# Altium schematic sheet ALIM_MOSFET.SchDoc
size A4; SheetNumber: 2; SheetTotal: 8
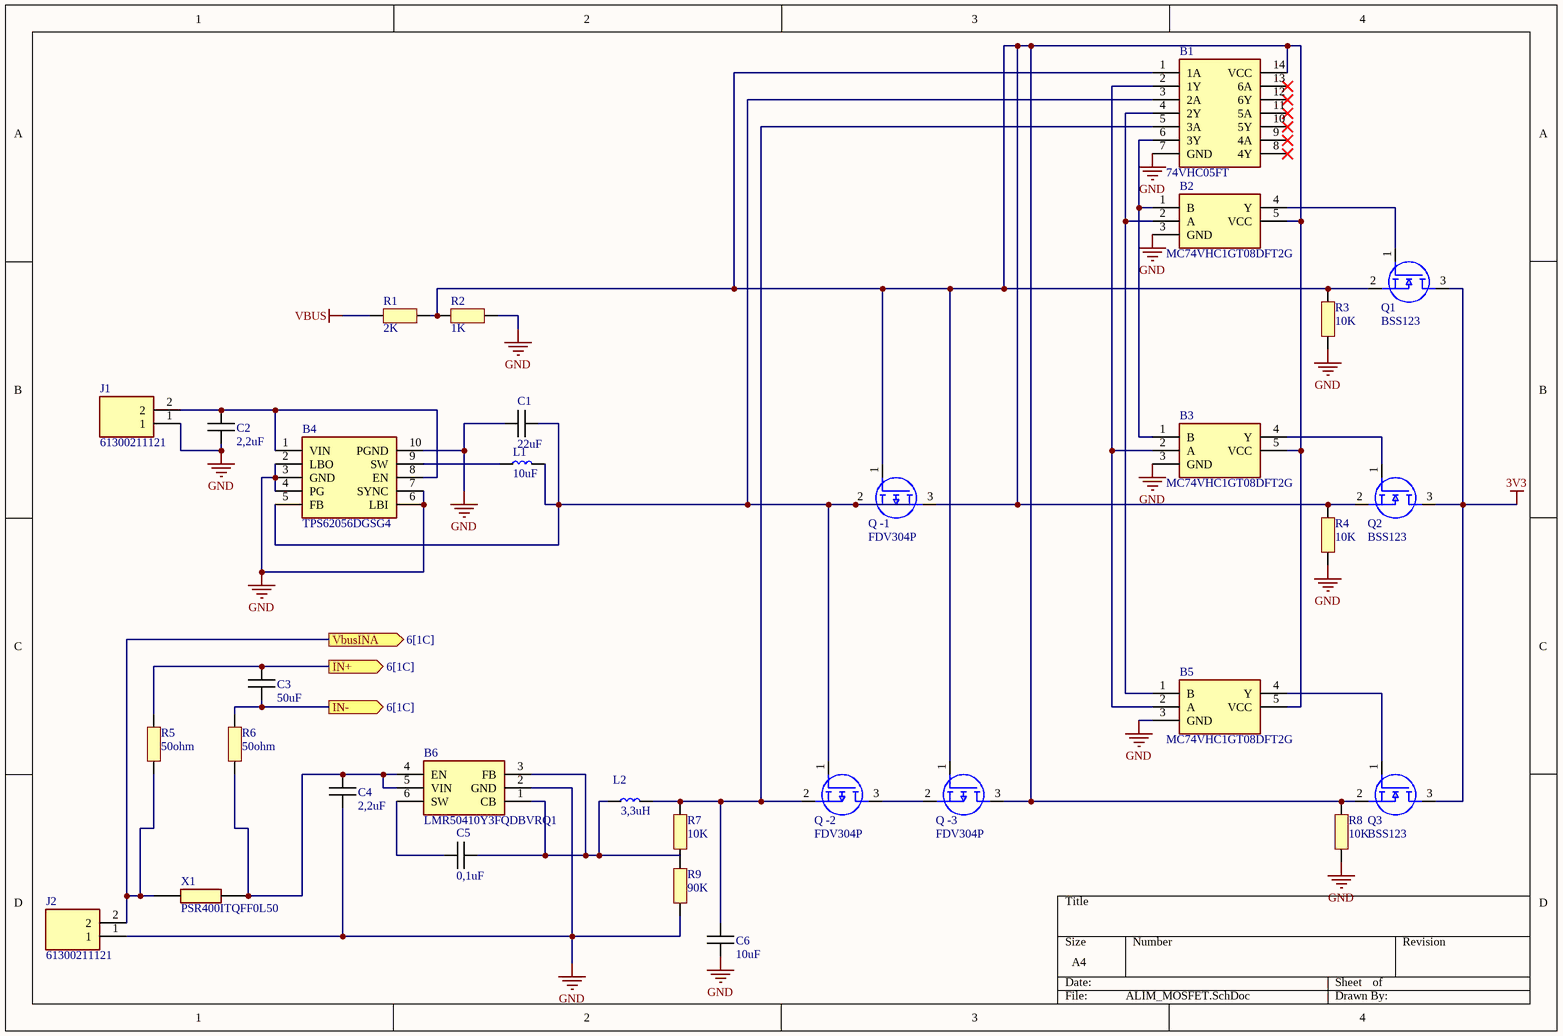
[diagram p0: ALIM_MOSFET.SchDoc]

## Parts
B1  74VHC05FT  [SOP65P640X120-14N]
B2  MC74VHC1GT08DFT2G  [SOT65P210X110-5N]
B3  MC74VHC1GT08DFT2G  [SOT65P210X110-5N]
B4  TPS62056DGSG4  [SOP50P490X110-10N]
B5  MC74VHC1GT08DFT2G  [SOT65P210X110-5N]
B6  LMR50410Y3FQDBVRQ1  [SOT95P280X145-6N]
C1  22uF  [CAPC1005X06N]
C2  2,2uF  [CAPC1005X06N]
C3  50uF  [CAPC1005X06N]
C4  2,2uF  [CAPC1005X06N]
C5  0,1uF  [CAPC1005X06N]
C6  10uF  [CAPC1005X06N]
J1  61300211121  [61300211121]
J2  61300211121  [61300211121]
L1  10uF  [LQPC1005X06N]
L2  3,3uH  [LQPC1005X06N]
Q1  BSS123  [BSS123]
Q2  BSS123  [BSS123]
Q3  BSS123  [BSS123]
Q_-1  FDV304P  [SOT95P251X112-3N]
Q_-2  FDV304P  [SOT95P251X112-3N]
Q_-3  FDV304P  [SOT95P251X112-3N]
R1  2K  [RESC1005X06N]
R2  1K  [RESC1005X06N]
R3  10K  [RESC1005X06N]
R4  10K  [RESC1005X06N]
R5  50ohm  [RESC1005X06N]
R6  50ohm  [RESC1005X06N]
R7  10K  [RESC1005X06N]
R8  10K  [RESC1005X06N]
R9  90K  [RESC1005X06N]
X1  PSR400ITQFF0L50  [RESC10052X200N]

## Ports
IN+ (out, see 6[1C]), IN- (out, see 6[1C]), VbusINA (out, see 6[1C])

## Nets
3V3: Q1.3(D) Q2.3(D) Q3.3(D)
GND: B1.7(GND) B2.3(GND) B3.3(GND) B4.2(LBO) B4.3(GND) B4.4(PG) B4.6(LBI) B4.7(SYNC) B4.10(PGND) B5.3(GND) B6.2(GND) C1.2 C2.2 C4.2 C6.2 J1.1 J2.1 R2.2 R3.2 R4.2 R8.2 R9.2
VBUS: R1.1
IN+: C3.1 R5.2 ; port IN+
IN-: C3.2 R6.2 ; port IN-
VbusINA: J2.2 R5.1 X1.1 ; port VbusINA
NetB1_1: B1.1(1A) B1.14(VCC) B2.5(VCC) B3.5(VCC) B5.5(VCC) Q1.2(S) Q2.2(S) Q3.2(S) Q_-1.1(G) Q_-1.3(D) Q_-3.1(G) Q_-3.3(D) R1.2 R2.1 R3.1 R4.1 R8.1
NetB1_2: B1.2(1Y) B3.2(A) B5.2(A)
NetB1_3: B1.3(2A) B4.5(FB) C1.1 L1.2 Q_-1.2(S) Q_-2.1(G)
NetB1_4: B1.4(2Y) B2.2(A) B5.1(B)
NetB1_5: B1.5(3A) C6.1 L2.2 Q_-2.2(S) R7.1
NetB1_6: B1.6(3Y) B2.1(B) B3.1(B)
NetB2_4: B2.4(Y) Q1.1(G)
NetB3_4: B3.4(Y) Q2.1(G)
NetB4_1: B4.1(VIN) B4.8(EN) C2.1 J1.2
NetB4_9: B4.9(SW) L1.1
NetB5_4: B5.4(Y) Q3.1(G)
NetB6_1: B6.1(CB) B6.3(FB) C5.1 L2.1 R9.1
NetB6_4: B6.4(EN) B6.5(VIN) C4.1 R6.1 X1.2
NetB6_6: B6.6(SW) C5.2
NetQ_-2_3: Q_-2.3(D) Q_-3.2(S)

Not connected (* = marked no-connect by the designer): B1 8(4Y)* 9(4A)* 10(5Y)* 11(5A)* 12(6Y)* 13(6A)*; R7 2

## Library data of the parts
B1 = 74VHC05FT: Logic Gates CMOS LOGIC IC INVERTER; Manufacturer_Name: Toshiba; Manufacturer_Part_Number: 74VHC05FT; Mouser Part Number: 757-74VHC05FT
B2 B3 B5 = MC74VHC1GT08DFT2G: Single 2-Input AND Gate, TTL Level; Manufacturer_Name: onsemi; Manufacturer_Part_Number: MC74VHC1GT08DFT2G; Parameter 3: *
B4 = TPS62056DGSG4: TEXAS INSTRUMENTS - TPS62056DGSG4 - Synchronous Buck (Step Down) Switching Regulator, Fixed, 2.7V-10Vin, 3.3V/0.8A out, 850kHz, VSSOP-10; Manufacturer_Name: Texas Instruments; Manufacturer_Part_Number: TPS62056DGSG4; Mouser Part Number: 595-TPS62056DGSG4
B6 = LMR50410Y3FQDBVRQ1: Régulateurs de tension de commutation Automotive qualified SIMPLE SWITCHER 4-V to 36-V, 1-A synchronous step-down converter 6-SOT-23 -40 to 150; Manufacturer_Name: Texas Instruments; Manufacturer_Part_Number: LMR50410Y3FQDBVRQ1; Mouser Part Number: 595-R50410Y3FQDBVRQ1
C1-C6 = Capacitor
J1 J2 = 61300211121: WURTH ELEKTRONIK - 61300211121 - HEADER, 2.54MM, PIN, THT, VERTICAL, 2WAY
L1 L2 = Bobine
Q1-Q3 = BSS123: BSS123 N-Channel MOSFET, 170 mA, 100 V PowerTrench, 3-Pin SOT-23 ON Semiconductor
Q_-1-Q_-3 = FDV304P: ON SEMICONDUCTOR - FDV304P - Power MOSFET, P Channel, 25 V, 460 mA, 1.22 ohm, SOT-23, Surface Mount; Manufacturer_Name: onsemi; Geometry.Height: 1.12mm; Manufacturer_Part_Number: FDV304P; Mouser Part Number: 512-FDV304P; Mouser Price/Stock: https://www.mouser.co.uk/ProductDetail/onsemi-Fairchild/FDV304P?qs=FOlmdCx%252BAA1BAlCQZu888w%3D%3D; Arrow Part Number: FDV304P; Arrow Price/Stock: https://www.arrow.com/en/products/fdv304p/on-semiconductor?utm_currency=USD&region=europe; Datasheet Link: https://componentsearchengine.com/Datasheets/2/FDV304P.pdf
R1-R9 = Resistor
X1 = PSR400ITQFF0L50: ROHM - PSR400ITQFF0L50 - SMD Current Sense Resistor, 500 ohm, PSR Series, 3921 [1052 Metric], 4 W, +/- 1%, Metal Strip; Manufacturer_Name: ROHM Semiconductor; Geometry.Height: 2mm; Manufacturer_Part_Number: PSR400ITQFF0L50; Mouser Part Number: 755-PSR400ITQFF0L50; Mouser Price/Stock: https://www.mouser.co.uk/ProductDetail/ROHM-Semiconductor/PSR400ITQFF0L50?qs=493kPxzlxfLaT1w5Mo%252BtHg%3D%3D; Arrow Part Number: *; Arrow Price/Stock: *; Datasheet Link: https://componentsearchengine.com/Datasheets/2/PSR400ITQFF0L50.pdf